# Altium schematic sheet Charge Controller.SchDoc: HIGH VOLTAGE BUCK/BOOST MULTI-CHEMISTRY BATTERY CHARGER (part 1 of 2)
size 513 x 386 mm; Date: 09-07-21; SheetNumber: 7; SheetTotal: 8; SKU#(-P): DCXXXXA-P; PCA BOM(-I): 700-DCXXXXA-I_REV01; SKU#(-D): DCXXXXA-D; SKU#(-Q): DCXXXXA-Q; SKU#(-V): DCXXXXA-V; SKU#(-F): DCXXXXA-F; SKU#(-O): DCXXXXA-O; PCA BOM(-K): 700-DCXXXXA-K_REV01; SKU#(-M): DCXXXXA-M; PCA BOM(-Y): 700-DCXXXXA-Y_REV01; PCA BOM(-Z): 700-DCXXXXA-Z_REV01; SKU#(-Y): DCXXXXA-Y; PCA BOM: 700-DC2044B_REV01; RevCode: 01; PCA BOM(-E): 700-DCXXXXA-E_REV01; SKU#: DC2044B; PCA BOM(-S): 700-DCXXXXA-S_REV01; Page Number: 1; SKU#(-E): DCXXXXA-E; SKU#(-X): DCXXXXA-X; Page Count: 1; SKU#(-G): DCXXXXA-G; PCA BOM(-W): 700-DCXXXXA-W_REV01; SKU#(-T): DCXXXXA-T; PCA BOM(-T): 700-DCXXXXA-L_REV01; SIZE: N/A; SKU#(-H): DCXXXXA-H; PCA BOM(-N): 700-DCXXXXA-N_REV01; SKU#(-K): DCXXXXA-K; SKU#(-L): DCXXXXA-L; PCA BOM(-U): 700-DCXXXXA-U_REV01; PCA BOM(-O): 700-DCXXXXA-O_REV01; IC NO.: LTC4020; SKU#(-W): DCXXXXA-W; SKU#(-R): DCXXXXA-R; PCA BOM(-Q): 700-DCXXXXA-Q_REV01; PCA BOM(-M): 700-DCXXXXA-M_REV01; SKU#(-I): DCXXXXA-I; PCA BOM(-L): 700-DCXXXXA-L_REV01; SKU#(-N): DCXXXXA-N; PCA BOM(-X): 700-DCXXXXA-X_REV01; PCA BOM(-F): 700-DCXXXXA-F_REV01; PCA BOM(-G): 700-DCXXXXA-G_REV01; PCA BOM(-V): 700-DCXXXXA-V_REV01; PCA BOM(-P): 700-DCXXXXA-P_REV01; SKU#(-Z): DCXXXXA-Z; PCA SCHEMATIC: 710-DC2044B_REV01; PCA BOM(-R): 700-DCXXXXA-R_REV01; SKU#(-J): DCXXXXA-J; PCA BOM(-J): 700-DCXXXXA-J_REV01; PCA BOM(-D): 700-DCXXXXA-D_REV01; PCB DESIGNER: NC; Variant Name: <Variant Name>; PCA ASS'Y DWG: 705-DC2044B_REV01; APP. ENG.: WAT; PCA BOM(-H): 700-DCXXXXA-H_REV01; SKU#(-S): DCXXXXA-S; SKU#(-U): DCXXXXA-U; DsnPath: C:\Users\temp\Documents\WPI\MQP\dc2044b\710-DC2044B_REV01_PCA_SCHEMATIC.DSN; SchematicName: SCHEMATIC1; PageName: PAGE1; PageSize: C; TopSchematic: True
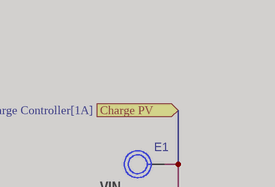
[diagram p0: Charge Controller.SchDoc, top left]
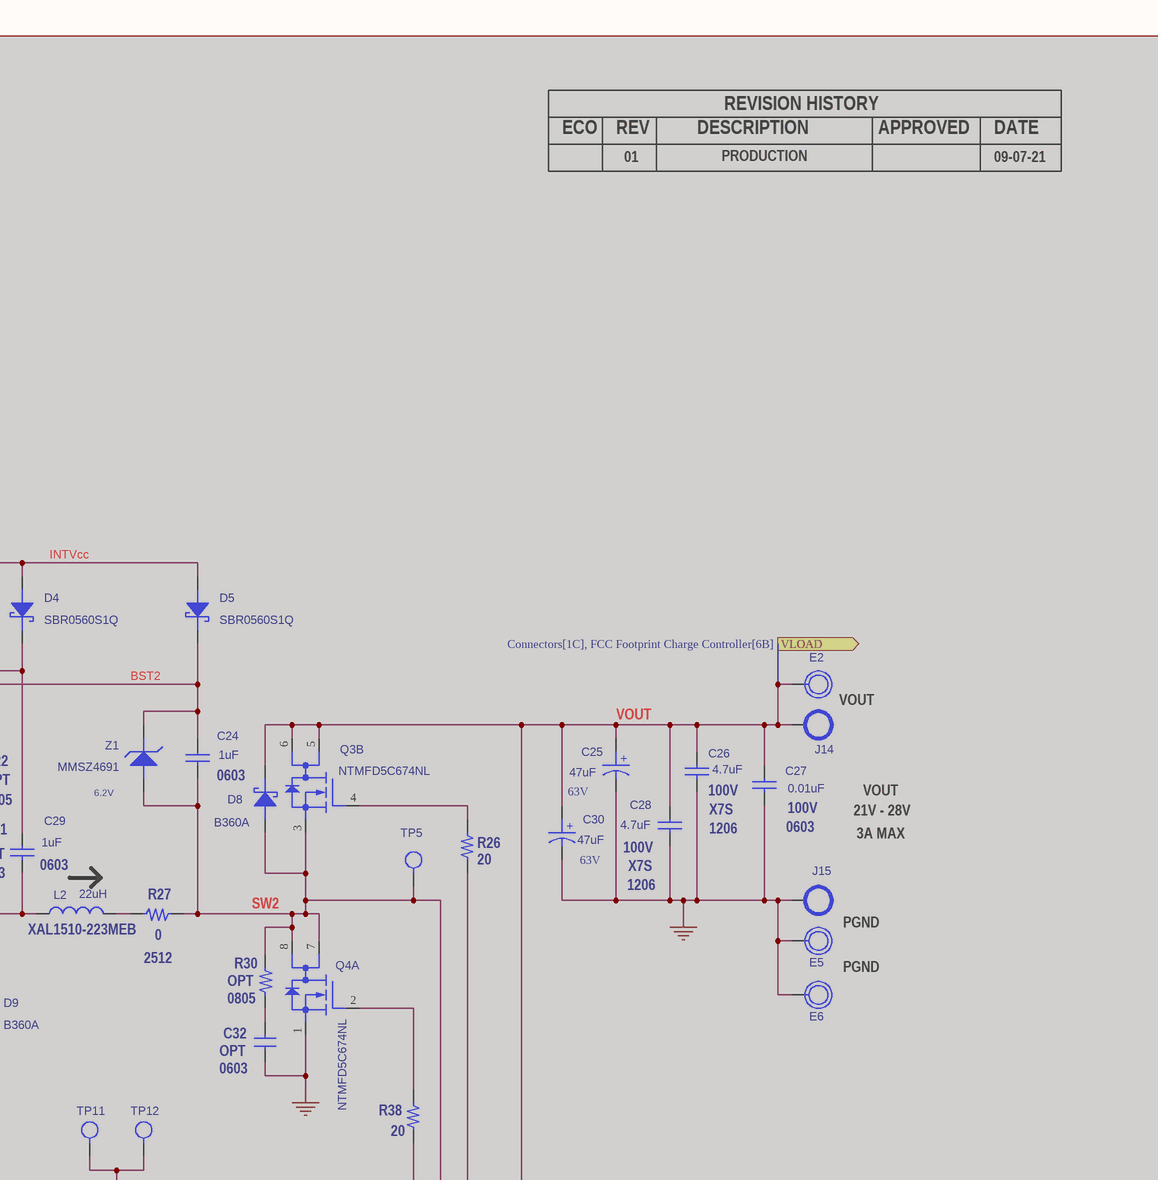
[diagram p1: Charge Controller.SchDoc, top right]
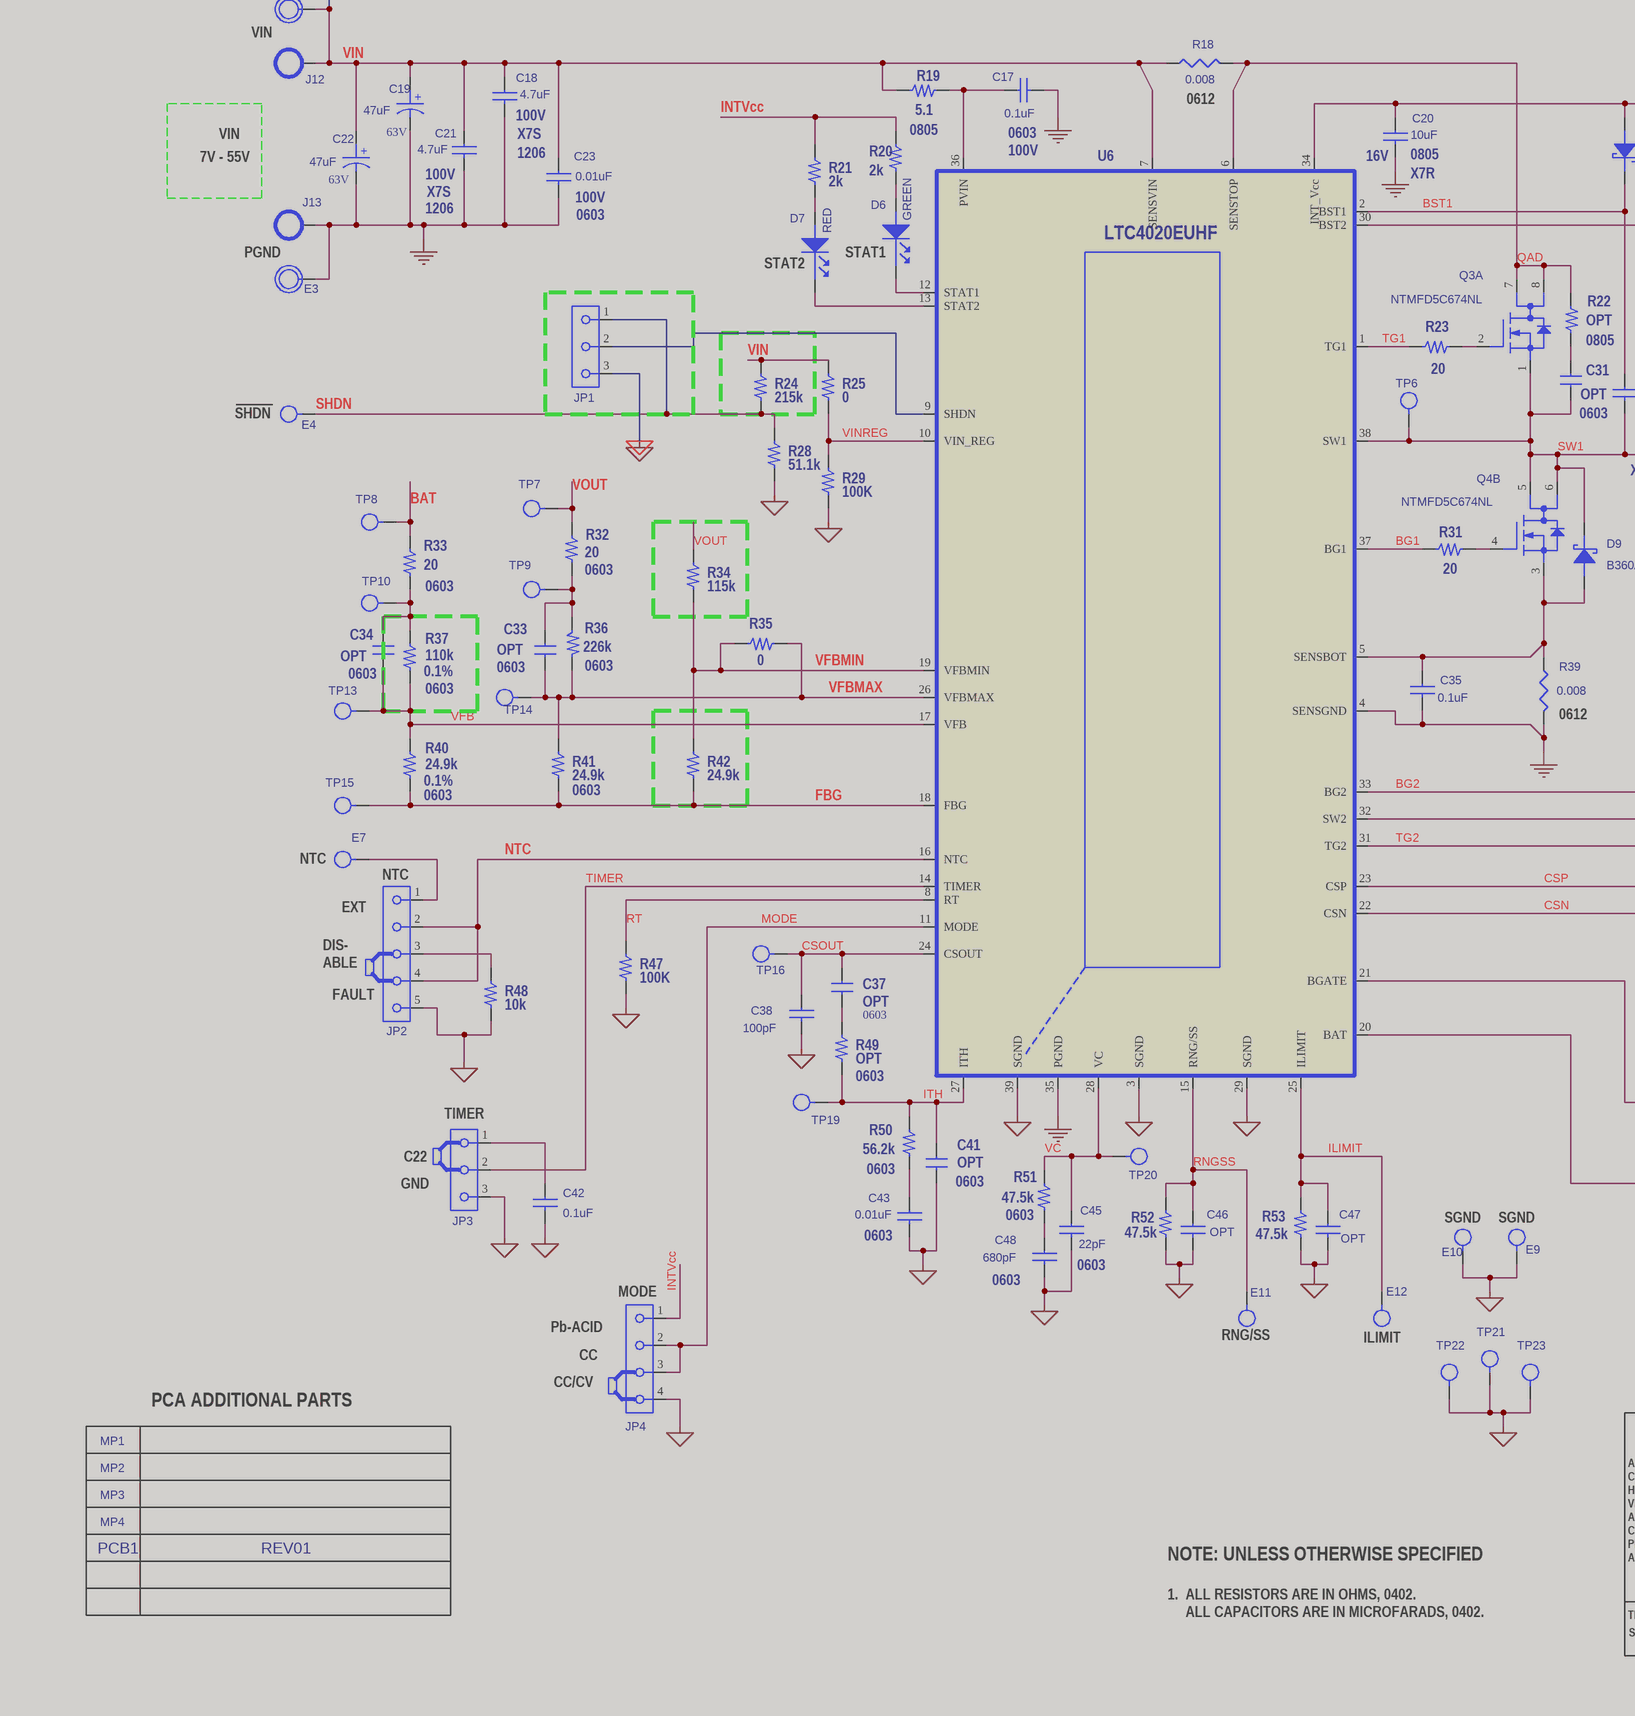
[diagram p2: Charge Controller.SchDoc, bottom left]
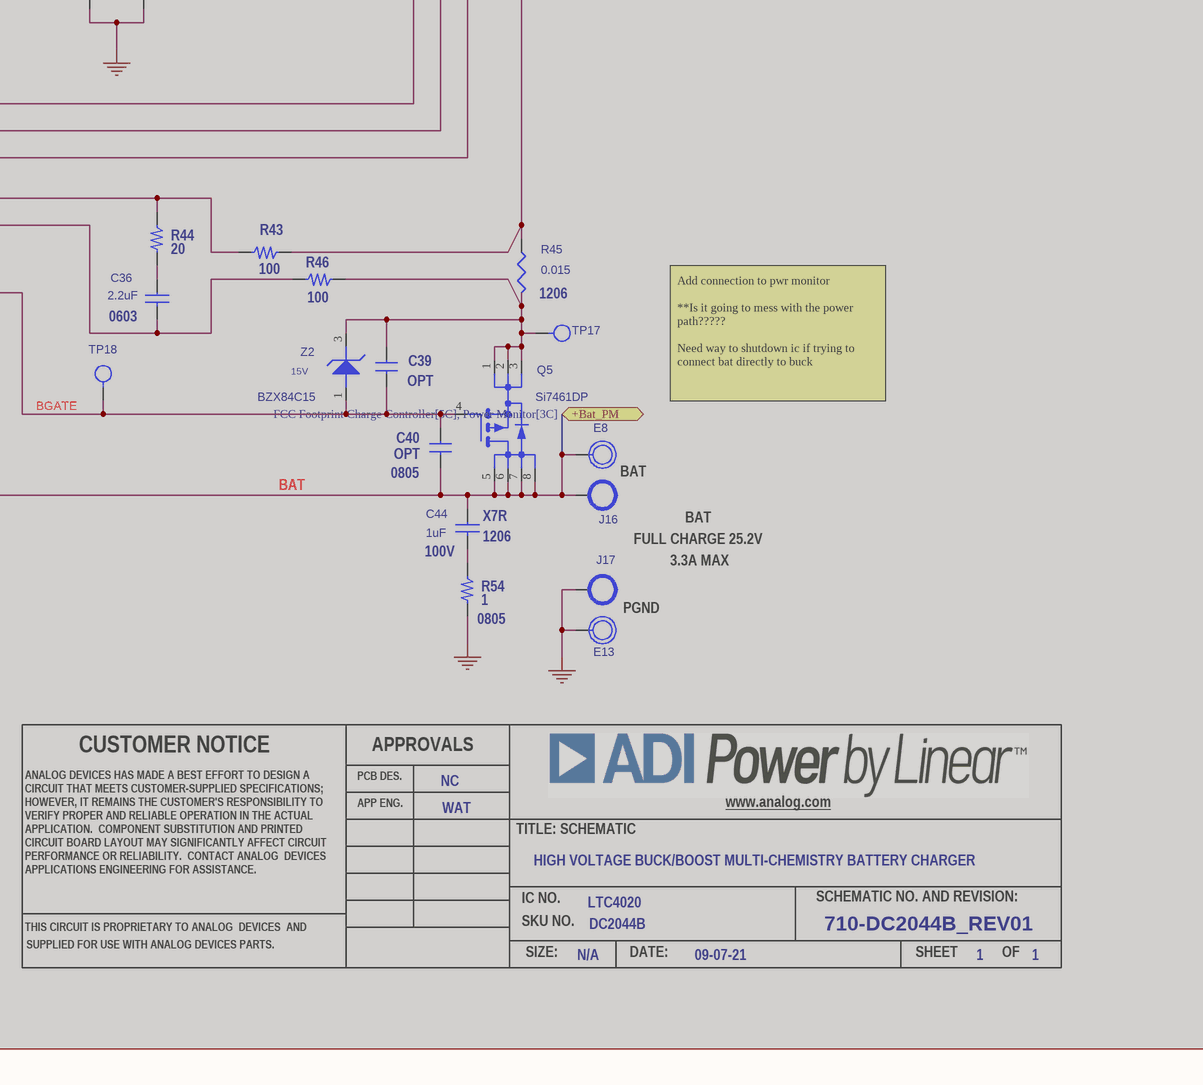
[diagram p3: Charge Controller.SchDoc, bottom right]

## Parts
*  SKU#: DC2044B  Page Number: 1  PCB DESIGNER: NC  PCA SCHEMATIC: 710-DC2044B_REV01  IC NO.: LTC4020  DATE: 09-07-21  APP. ENG.: WAT  Title: HIGH VOLTAGE BUCK/BOOST MULTI-CHEMISTRY BATTERY CHARGER  (graphical)  (masked out: inside a compile mask, not in the netlist)
C17  0.1uF  Rated Voltage: 100V  Package Size: 0603  [CC0603N]  (masked out: inside a compile mask, not in the netlist)
C18  4.7uF  Package Size: 1206  Dielectric Type: X7S  Rated Voltage: 100V  [CC1206N]  (masked out: inside a compile mask, not in the netlist)
C19  47uF  Rated Voltage: 63V  [PANASONIC_ZA_8X10.2]  (masked out: inside a compile mask, not in the netlist)
C20  10uF  Rated Voltage: 16V  Dielectric Type: X7R  Package Size: 0805  [CC0805N]  (masked out: inside a compile mask, not in the netlist)
C21  4.7uF  Package Size: 1206  Dielectric Type: X7S  Rated Voltage: 100V  [CC1206N]  (masked out: inside a compile mask, not in the netlist)
C22  47uF  Rated Voltage: 63V  [PANASONIC_ZA_8X10.2]  (masked out: inside a compile mask, not in the netlist)
C23  0.01uF  Rated Voltage: 100V  Package Size: 0603  [CC0603N]  (masked out: inside a compile mask, not in the netlist)
C24  1uF  Package Size: 0603  [CC0603N]  (masked out: inside a compile mask, not in the netlist)
C25  47uF  Rated Voltage: 63V  [PANASONIC_ZA_8X10.2]  (masked out: inside a compile mask, not in the netlist)
C26  4.7uF  Package Size: 1206  Dielectric Type: X7S  Rated Voltage: 100V  [CC1206N]  (masked out: inside a compile mask, not in the netlist)
C27  0.01uF  Rated Voltage: 100V  Package Size: 0603  [CC0603N]  (masked out: inside a compile mask, not in the netlist)
C28  4.7uF  Rated Voltage: 100V  Dielectric Type: X7S  Package Size: 1206  [CC1206N]  (masked out: inside a compile mask, not in the netlist)
C29  1uF  Package Size: 0603  [CC0603N]  (masked out: inside a compile mask, not in the netlist)
C30  47uF  Rated Voltage: 63V  [PANASONIC_ZA_8X10.2]  (masked out: inside a compile mask, not in the netlist)
C31  OPT  Package Size: 0603  [CC0603N]  (masked out: inside a compile mask, not in the netlist)
C32  OPT  Package Size: 0603  [CC0603N]  (masked out: inside a compile mask, not in the netlist)
C33  OPT  Package Size: 0603  [CC0603N]  (masked out: inside a compile mask, not in the netlist)
C34  OPT  Package Size: 0603  [CC0603N]  (masked out: inside a compile mask, not in the netlist)
C35  0.1uF  [CC0402N]  (masked out: inside a compile mask, not in the netlist)
C36  2.2uF  Package Size: 0603  [CC0603N]  (masked out: inside a compile mask, not in the netlist)
C37  OPT  Package Size: 0603  [CC0603N]  (masked out: inside a compile mask, not in the netlist)
C38  100pF  [CC0402N]  (masked out: inside a compile mask, not in the netlist)
C39  OPT  [CC0603N]  (masked out: inside a compile mask, not in the netlist)
C40  OPT  Package Size: 0805  [CC0805N]  (masked out: inside a compile mask, not in the netlist)
C41  OPT  Package Size: 0603  [CC0603N]  (masked out: inside a compile mask, not in the netlist)
C42  0.1uF  [CC0402N]  (masked out: inside a compile mask, not in the netlist)
C43  0.01uF  Package Size: 0603  [CC0603N]  (masked out: inside a compile mask, not in the netlist)
C44  1uF  Rated Voltage: 100V  Temperature Coefficient: X7R  Package Size: 1206  [CC1206N]  (masked out: inside a compile mask, not in the netlist)
C45  22pF  Package Size: 0603  [CC0603N]  (masked out: inside a compile mask, not in the netlist)
C46  OPT  [CC0402N]  (masked out: inside a compile mask, not in the netlist)
C47  OPT  [CC0402N]  (masked out: inside a compile mask, not in the netlist)
C48  680pF  Package Size: 0603  [CC0603N]  (masked out: inside a compile mask, not in the netlist)
D4  SBR0560S1Q  [SOD-123N]  (masked out: inside a compile mask, not in the netlist)
D5  SBR0560S1Q  [SOD-123N]  (masked out: inside a compile mask, not in the netlist)
D6  GREEN  [LED_0603]  (masked out: inside a compile mask, not in the netlist)
D7  RED  [LED_0603]  (masked out: inside a compile mask, not in the netlist)
D8  B360A  [SMA-N]  (masked out: inside a compile mask, not in the netlist)
D9  B360A  [SMA-N]  (masked out: inside a compile mask, not in the netlist)
E1  TEST POINT  [MILLMAX2501]  (value not drawn)  (masked out: inside a compile mask, not in the netlist)
E2  TEST POINT  [MILLMAX2501]  (value not drawn)  (masked out: inside a compile mask, not in the netlist)
E3  TEST POINT  [MILLMAX2501]  (value not drawn)  (masked out: inside a compile mask, not in the netlist)
E4  TEST POINT  [MILLMAX2308]  (value not drawn)  (masked out: inside a compile mask, not in the netlist)
E5  TEST POINT  [MILLMAX2501]  (value not drawn)  (masked out: inside a compile mask, not in the netlist)
E6  TEST POINT  [MILLMAX2501]  (value not drawn)  (masked out: inside a compile mask, not in the netlist)
E7  TEST POINT  [MILLMAX2308]  (value not drawn)  (masked out: inside a compile mask, not in the netlist)
E8  TEST POINT  [MILLMAX2501]  (value not drawn)  (masked out: inside a compile mask, not in the netlist)
E9  TEST POINT  [MILLMAX2308]  (value not drawn)  (masked out: inside a compile mask, not in the netlist)
E10  TEST POINT  [MILLMAX2308]  (value not drawn)  (masked out: inside a compile mask, not in the netlist)
E11  TEST POINT  [MILLMAX2308]  (value not drawn)  (masked out: inside a compile mask, not in the netlist)
E12  TEST POINT  [MILLMAX2308]  (value not drawn)  (masked out: inside a compile mask, not in the netlist)
E13  TEST POINT  [MILLMAX2501]  (value not drawn)  (masked out: inside a compile mask, not in the netlist)
J12  BANANA JACK  [KEY-575-4]  (value not drawn)  (masked out: inside a compile mask, not in the netlist)
J13  BANANA JACK  [KEY-575-4]  (value not drawn)  (masked out: inside a compile mask, not in the netlist)
J14  BANANA JACK  [KEY-575-4]  (value not drawn)  (masked out: inside a compile mask, not in the netlist)
J15  BANANA JACK  [KEY-575-4]  (value not drawn)  (masked out: inside a compile mask, not in the netlist)
J16  BANANA JACK  [KEY-575-4]  (value not drawn)  (masked out: inside a compile mask, not in the netlist)
J17  BANANA JACK  [KEY-575-4]  (value not drawn)  (masked out: inside a compile mask, not in the netlist)
JP1  HDR  [HD1X3-079]  (value not drawn)  (masked out: inside a compile mask, not in the netlist)
JP2  HEADER  [HD1X5-079]  (value not drawn)  (masked out: inside a compile mask, not in the netlist)
JP3  HDR  [HD1X3-079]  (value not drawn)  (masked out: inside a compile mask, not in the netlist)
JP4  HDR  [HD1X4-079]  (value not drawn)  (masked out: inside a compile mask, not in the netlist)
L2  22uH  Manufacturer PN: XAL1510-223MEB  [COILCRAFT-XAL1510]  (masked out: inside a compile mask, not in the netlist)
MP1  STANDOFF  [MTG-8831]  (value not drawn)  (masked out: inside a compile mask, not in the netlist)
MP2  STANDOFF  [MTG-8831]  (value not drawn)  (masked out: inside a compile mask, not in the netlist)
MP3  STANDOFF  [MTG-8831]  (value not drawn)  (masked out: inside a compile mask, not in the netlist)
MP4  STANDOFF  [MTG-8831]  (value not drawn)  (masked out: inside a compile mask, not in the netlist)
PCB1  BOM Notes: REV01  (hidden comment: PCB, DC2044B)  (masked out: inside a compile mask, not in the netlist)
Q3  NTMFD5C674NL  [ONSEMI-DFN8-SO-8FL]  (parts A,B of 2)  (masked out: inside a compile mask, not in the netlist)
Q4  NTMFD5C674NL  [ONSEMI-DFN8-SO-8FL]  (parts A,B of 2)  (masked out: inside a compile mask, not in the netlist)
Q5  Si7461DP  [VISHAY_PPAK_SO-8]  (masked out: inside a compile mask, not in the netlist)
R18  0.008  [SUSUMU-PRL1632]  (masked out: inside a compile mask, not in the netlist)
R19  5.1  Package Size: 0805  [CR0805N]  (masked out: inside a compile mask, not in the netlist)
R20  2k  [CR0402N]  (masked out: inside a compile mask, not in the netlist)
R21  2k  [CR0402N]  (masked out: inside a compile mask, not in the netlist)
R22  OPT  Package Size: 0805  [CR0805M]  (masked out: inside a compile mask, not in the netlist)
R23  20  [CR0402N]  (masked out: inside a compile mask, not in the netlist)
R24  215k  [CR0402N]  (masked out: inside a compile mask, not in the netlist)
R25  0  [CR0402N]  (masked out: inside a compile mask, not in the netlist)
R26  20  [CR0402N]  (masked out: inside a compile mask, not in the netlist)
R27  0  Package Size: 2512  [VISHAY-WSL_9-2512]  (masked out: inside a compile mask, not in the netlist)
R28  51.1k  [CR0402N]  (masked out: inside a compile mask, not in the netlist)
R29  100K  [CR0402N]  (masked out: inside a compile mask, not in the netlist)
R30  OPT  Package Size: 0805  [CR0805M]  (masked out: inside a compile mask, not in the netlist)
R31  20  [CR0402N]  (masked out: inside a compile mask, not in the netlist)
R32  20  Package Size: 0603  [CR0603N]  (masked out: inside a compile mask, not in the netlist)
R33  20  Package Size: 0603  [CR0603N]  (masked out: inside a compile mask, not in the netlist)
R34  115k  [CR0402N]  (masked out: inside a compile mask, not in the netlist)
R35  0  [CR0402N]  (masked out: inside a compile mask, not in the netlist)
R36  226k  Package Size: 0603  [CR0603N]  (masked out: inside a compile mask, not in the netlist)
R37  110k  Package Size: 0603  Tolerance: 0.1%  [CR0603N]  (masked out: inside a compile mask, not in the netlist)
R38  20  [CR0402N]  (masked out: inside a compile mask, not in the netlist)
R39  0.008  [SUSUMU-PRL1632]  (masked out: inside a compile mask, not in the netlist)
R40  24.9k  Package Size: 0603  Tolerance: 0.1%  [CR0603N]  (masked out: inside a compile mask, not in the netlist)
R41  24.9k  Package Size: 0603  [CR0603N]  (masked out: inside a compile mask, not in the netlist)
R42  24.9k  [CR0402N]  (masked out: inside a compile mask, not in the netlist)
R43  100  [CR0402N]  (masked out: inside a compile mask, not in the netlist)
R44  20  [CR0402N]  (masked out: inside a compile mask, not in the netlist)
R45  0.015  Package Size: 1206  [SUSUMU-KRL1632]  (masked out: inside a compile mask, not in the netlist)
R46  100  [CR0402N]  (masked out: inside a compile mask, not in the netlist)
R47  100K  [CR0402N]  (masked out: inside a compile mask, not in the netlist)
R48  10k  [CR0402N]  (masked out: inside a compile mask, not in the netlist)
R49  OPT  Package Size: 0603  [CR0603N]  (masked out: inside a compile mask, not in the netlist)
R50  56.2k  Package Size: 0603  [CR0603N]  (masked out: inside a compile mask, not in the netlist)
R51  47.5k  Package Size: 0603  [CR0603N]  (masked out: inside a compile mask, not in the netlist)
R52  47.5k  [CR0402N]  (masked out: inside a compile mask, not in the netlist)
R53  47.5k  [CR0402N]  (masked out: inside a compile mask, not in the netlist)
R54  1  Package Size: 0805  [CR0805M]  (masked out: inside a compile mask, not in the netlist)
TP5  TEST PAD  [PADSTYLE1]  (value not drawn)  (masked out: inside a compile mask, not in the netlist)
TP6  TEST PAD  [PADSTYLE1]  (value not drawn)  (masked out: inside a compile mask, not in the netlist)
TP7  TEST PAD  [PADSTYLE1]  (value not drawn)  (masked out: inside a compile mask, not in the netlist)
TP8  TEST PAD  [PADSTYLE1]  (value not drawn)  (masked out: inside a compile mask, not in the netlist)
TP9  TEST PAD  [PADSTYLE1]  (value not drawn)  (masked out: inside a compile mask, not in the netlist)
TP10  TEST PAD  [PADSTYLE1]  (value not drawn)  (masked out: inside a compile mask, not in the netlist)
TP11  TEST PAD  [PADSTYLE1]  (value not drawn)  (masked out: inside a compile mask, not in the netlist)
TP12  TEST PAD  [PADSTYLE1]  (value not drawn)  (masked out: inside a compile mask, not in the netlist)
TP13  TEST PAD  [PADSTYLE1]  (value not drawn)  (masked out: inside a compile mask, not in the netlist)
TP14  TEST PAD  [PADSTYLE1]  (value not drawn)  (masked out: inside a compile mask, not in the netlist)
TP15  TEST PAD  [PADSTYLE1]  (value not drawn)  (masked out: inside a compile mask, not in the netlist)
TP16  TEST PAD  [PADSTYLE1]  (value not drawn)  (masked out: inside a compile mask, not in the netlist)
TP17  TEST PAD  [PADSTYLE1]  (value not drawn)  (masked out: inside a compile mask, not in the netlist)
TP18  TEST PAD  [PADSTYLE1]  (value not drawn)  (masked out: inside a compile mask, not in the netlist)
TP19  TEST PAD  [PADSTYLE1]  (value not drawn)  (masked out: inside a compile mask, not in the netlist)
TP20  TEST PAD  [PADSTYLE1]  (value not drawn)  (masked out: inside a compile mask, not in the netlist)
TP21  TEST PAD  [PADSTYLE1]  (value not drawn)  (masked out: inside a compile mask, not in the netlist)
TP22  TEST PAD  [PADSTYLE1]  (value not drawn)  (masked out: inside a compile mask, not in the netlist)
TP23  TEST PAD  [PADSTYLE1]  (value not drawn)  (masked out: inside a compile mask, not in the netlist)
U6  LTC4020EUHF  [LTC-QFN-38-1701]  (masked out: inside a compile mask, not in the netlist)
XJP1  SHUNT  [SAMTEC-SHUNT-079]  (value not drawn)  (masked out: inside a compile mask, not in the netlist)
XJP2  SHUNT  [SAMTEC-SHUNT-079]  (value not drawn)  (masked out: inside a compile mask, not in the netlist)
XJP3  SHUNT  [SAMTEC-SHUNT-079]  (value not drawn)  (masked out: inside a compile mask, not in the netlist)
Z1  MMSZ4691  Rated Voltage or Zener Voltage: 6.2V  [SOD-123N]  (masked out: inside a compile mask, not in the netlist)
Z2  BZX84C15  Rated Voltage or Zener Voltage: 15V  [SOT23-3N]  (masked out: inside a compile mask, not in the netlist)

## Ports
+Bat_PM (bidir, see FCC Footprint Charge Controller[5C], Power Monitor[3C]), Charge PV (in, see Connectors[1D], Connectors[2A], Connectors[4A], FCC Footprint Charge Controller[1A]), VLOAD (out, see Connectors[1C], FCC Footprint Charge Controller[6B])

## Notes on the sheet
- REVISION HISTORY
- ECO
- REV
- 01
- DESCRIPTION
- PRODUCTION
- APPROVED
- DATE
- 09-07-21
- VIN
- (near R18) 0612
- 7V - 55V
- PGND
- (near D7) STAT2
- (near D6) STAT1
- VOUT
- 21V - 28V
- 3A MAX
- (near E4) SHDN
- (near R39) 0612
- (near E7) NTC
- NTC
- (near XJP1) EXT
- (near XJP1) DIS-
  ABLE
- FAULT
- Add connection to pwr monitor
  **Is it going to mess with the power path?????
  Need way to shutdown ic if trying to connect bat directly to buck
- TIMER
- GND
- (near XJP2) C22
- (near E10) SGND
- (near E9) SGND
- BAT
- FULL CHARGE 25.2V
- 3.3A MAX
- (near XJP3) Pb-ACID
- (near JP4) MODE
- (near E11) RNG/SS
- (near E12) ILIMIT
- PCA ADDITIONAL PARTS
- (near XJP3) CC/CV
- (near XJP3) CC
- NOTE: UNLESS OTHERWISE SPECIFIED
- 1.  ALL RESISTORS ARE IN OHMS, 0402.
  ALL CAPACITORS ARE IN MICROFARADS, 0402.
- (in symbol CAP_P_ALT) +
- (in symbol TITLEBLK_REV09_2) CUSTOMER NOTICE; APPROVALS; PCB DES.; APP ENG.; www.analog.com; TITLE: SCHEMATIC; ANALOG DEVICES HAS MADE A BEST EFFORT TO DESIGN A / CIRCUIT THAT MEETS CUSTOMER-SUPPLIED SPECIFICATIONS; / HOWEVER, IT REMAINS THE CUSTOMER'S RESPONSIBILITY TO / VERIFY PROPER AND RELIABLE OPERATION IN THE ACTUAL / APPLICATION.  COMPONENT SUBSTITUTION AND PRINTED / CIRCUIT BOARD LAYOUT MAY SIGNIFICANTLY AFFECT CIRCUIT / PERFORMANCE OR RELIABILITY.  CONTACT ANALOG  DEVICES / APPLICATIONS ENGINEERING FOR ASSISTANCE.; IC NO.; SCHEMATIC NO. AND REVISION:; THIS CIRCUIT IS PROPRIETARY TO ANALOG  DEVICES  AND; SKU NO.; SUPPLIED FOR USE WITH ANALOG DEVICES PARTS.; SIZE:; DATE:; SHEET; OF